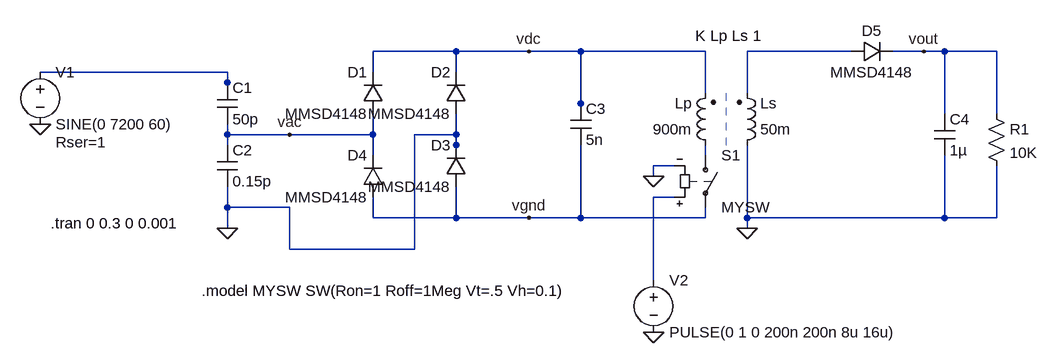
[diagram p0: schematic circuit1.asc]
circuit1.asc, the LTspice schematic file:
Version 4
SHEET 1 1680 680
WIRE 752 128 624 128
WIRE 864 128 752 128
WIRE 944 128 864 128
WIRE 1136 128 944 128
WIRE 1360 128 1200 128
WIRE 1472 128 1424 128
WIRE 1504 128 1472 128
WIRE 1584 128 1504 128
WIRE 400 160 112 160
WIRE 624 160 624 128
WIRE 752 160 752 128
WIRE 400 176 400 160
WIRE 400 192 400 176
WIRE 1136 192 1136 128
WIRE 1200 192 1200 128
WIRE 944 208 944 128
WIRE 944 224 944 208
WIRE 1504 224 1504 128
WIRE 1584 224 1584 128
WIRE 400 256 400 240
WIRE 496 256 400 256
WIRE 624 256 624 224
WIRE 624 256 496 256
WIRE 752 256 752 224
WIRE 752 256 688 256
WIRE 400 272 400 256
WIRE 752 272 752 256
WIRE 624 288 624 256
WIRE 752 288 752 272
WIRE 1136 288 1136 272
WIRE 1088 304 1056 304
WIRE 1056 320 1056 304
WIRE 1088 352 1056 352
WIRE 400 368 400 336
WIRE 496 368 400 368
WIRE 624 384 624 352
WIRE 752 384 752 336
WIRE 752 384 624 384
WIRE 864 384 752 384
WIRE 944 384 944 272
WIRE 944 384 864 384
WIRE 1136 384 1136 368
WIRE 1136 384 944 384
WIRE 1200 384 1200 272
WIRE 1504 384 1504 288
WIRE 1504 384 1200 384
WIRE 1584 384 1584 304
WIRE 1584 384 1504 384
WIRE 400 400 400 368
WIRE 1200 400 1200 384
WIRE 496 432 496 368
WIRE 688 432 688 256
WIRE 688 432 496 432
WIRE 1056 480 1056 352
FLAG 112 240 0
FLAG 400 400 0
FLAG 864 128 vdc
FLAG 864 384 vgnd
FLAG 496 256 vac
FLAG 1056 320 0
FLAG 1056 560 0
FLAG 1200 400 0
FLAG 1472 128 vout
SYMBOL voltage 112 144 R0
WINDOW 123 0 0 Left 0
WINDOW 39 24 124 Left 2
SYMATTR SpiceLine Rser=1
SYMATTR InstName V1
SYMATTR Value SINE(0 7200 60)
SYMBOL cap 384 176 R0
SYMATTR InstName C1
SYMATTR Value 50p
SYMBOL cap 384 272 R0
SYMATTR InstName C2
SYMATTR Value 0.15p
SYMBOL cap 928 208 R0
SYMATTR InstName C3
SYMATTR Value 5n
SYMBOL ind2 1152 288 R180
WINDOW 0 36 80 Left 2
WINDOW 3 36 40 Left 2
SYMATTR InstName Lp
SYMATTR Value 900m
SYMATTR Type ind
SYMATTR SpiceLine Rser=3
SYMBOL ind2 1184 288 M180
WINDOW 0 36 80 Left 2
WINDOW 3 36 40 Left 2
SYMATTR InstName Ls
SYMATTR Value 50m
SYMATTR Type ind
SYMATTR SpiceLine Rser=0.2
SYMBOL res 1568 208 R0
SYMATTR InstName R1
SYMATTR Value 10K
SYMBOL sw 1136 272 R0
SYMATTR InstName S1
SYMATTR Value MYSW
SYMBOL voltage 1056 464 R0
WINDOW 123 0 0 Left 0
WINDOW 39 0 0 Left 0
SYMATTR InstName V2
SYMATTR Value PULSE(0 1 0 200n 200n 8u 16u)
SYMBOL cap 1488 224 R0
SYMATTR InstName C4
SYMATTR Value 1µ
SYMBOL diode 640 224 R180
WINDOW 0 24 64 Left 2
WINDOW 3 24 0 Left 2
SYMATTR InstName D1
SYMATTR Value MMSD4148
SYMBOL diode 768 224 R180
WINDOW 0 24 64 Left 2
WINDOW 3 24 0 Left 2
SYMATTR InstName D2
SYMATTR Value MMSD4148
SYMBOL diode 768 336 R180
WINDOW 0 24 64 Left 2
WINDOW 3 24 0 Left 2
SYMATTR InstName D3
SYMATTR Value MMSD4148
SYMBOL diode 640 352 R180
WINDOW 0 24 64 Left 2
WINDOW 3 24 0 Left 2
SYMATTR InstName D4
SYMATTR Value MMSD4148
SYMBOL diode 1360 144 R270
WINDOW 0 32 32 VTop 2
WINDOW 3 0 32 VBottom 2
SYMATTR InstName D5
SYMATTR Value MMSD4148
TEXT 128 392 Left 2 !.tran 0 0.3 0 0.001
TEXT 1120 104 Left 2 !K Lp Ls 1
TEXT 360 496 Left 2 !.model MYSW SW(Ron=1 Roff=1Meg Vt=.5 Vh=0.1)
LINE Normal 1168 272 1168 192 2

The netlist it stands for:
* circuit1.asc
V1 N002 0 SINE(0 7200 60) Rser=1
C1 N002 vac 50p
C2 vac 0 0.15p
C3 vdc vgnd 5n
Lp N003 vdc 900m Rser=3
Ls 0 N001 50m Rser=0.2
R1 vout 0 10K
S1 N003 vgnd N004 0 MYSW
V2 N004 0 PULSE(0 1 0 200n 200n 8u 16u)
C4 vout 0 1µ
D1 vac vdc MMSD4148
D2 0 vdc MMSD4148
D3 vgnd 0 MMSD4148
D4 vgnd vac MMSD4148
D5 N001 vout MMSD4148
.model D D
.lib standard.dio
.tran 0 0.3 0 0.001
K Lp Ls 1
.model MYSW SW(Ron=1 Roff=1Meg Vt=.5 Vh=0.1)
.backanno
.end